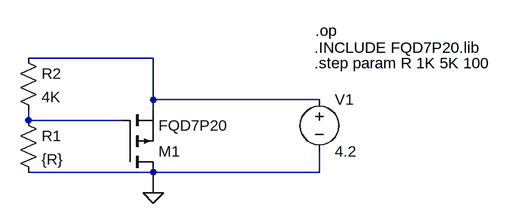
[diagram p0: schematic PMOS+NTC Discharge.asc]
PMOS+NTC Discharge.asc, the LTspice schematic file:
Version 4
SHEET 1 880 680
WIRE 96 96 -96 96
WIRE 96 160 96 96
WIRE 352 160 96 160
WIRE 96 176 96 160
WIRE -96 192 -96 176
WIRE 48 192 -96 192
WIRE 96 272 -96 272
WIRE 352 272 352 240
WIRE 352 272 96 272
WIRE 96 304 96 272
FLAG 96 304 0
SYMBOL pmos 48 272 M180
SYMATTR InstName M1
SYMATTR Value FQD7P20
SYMATTR Prefix X
SYMBOL res -112 176 R0
SYMATTR InstName R1
SYMATTR Value {R}
SYMBOL res -112 80 R0
SYMATTR InstName R2
SYMATTR Value 4K
SYMBOL voltage 352 144 R0
WINDOW 123 0 0 Left 0
WINDOW 39 24 124 Left 2
SYMATTR InstName V1
SYMATTR Value 4.2
TEXT 346 54 Left 2 !.op
TEXT 344 80 Left 2 !.INCLUDE FQD7P20.lib
TEXT 344 104 Left 2 !.step param R 1K 5K 100

The netlist it stands for:
* PMOS+NTC Discharge.asc
XM1 0 N002 N001 FQD7P20  ; pins D G S
R1 N002 0 {R}
R2 N001 N002 4K
V1 N001 0 4.2
.op
.INCLUDE FQD7P20.lib
.step param R 1K 5K 100
.backanno
.end